# Altium schematic sheet IRF7314.SchDoc
size A4
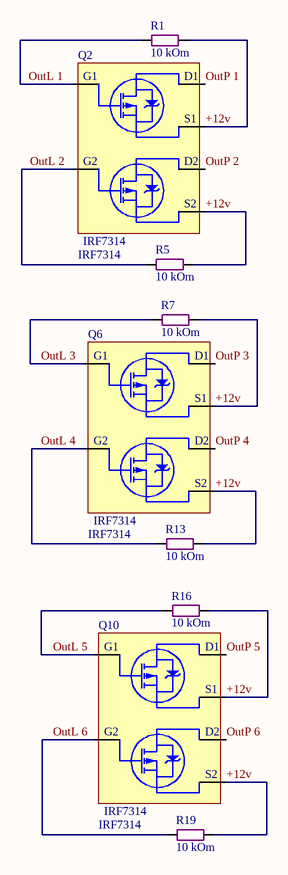
[diagram p0: IRF7314.SchDoc]

## Parts
Q2  IRF7314  [TSOP-6 (M)]
Q6  IRF7314  [TSOP-6 (M)]
Q10  IRF7314  [TSOP-6 (M)]
R1  10 kOm  [SMD 0603 (1608)]
R5  10 kOm  [SMD 0603 (1608)]
R7  10 kOm  [SMD 0603 (1608)]
R13  10 kOm  [SMD 0603 (1608)]
R16  10 kOm  [SMD 0603 (1608)]
R19  10 kOm  [SMD 0603 (1608)]

## Nets
+12v: Q2.2(S2) Q2.5(S1) Q6.2(S2) Q6.5(S1) Q10.2(S2) Q10.5(S1) R1.1 R5.1 R7.1 R13.1 R16.1 R19.1
OutL 1: Q2.1(G1) R1.2
OutL 2: Q2.3(G2) R5.2
OutL 3: Q6.1(G1) R7.2
OutL 4: Q6.3(G2) R13.2
OutL 5: Q10.1(G1) R16.2
OutL 6: Q10.3(G2) R19.2
OutP 1: Q2.6(D1)
OutP 2: Q2.4(D2)
OutP 3: Q6.6(D1)
OutP 4: Q6.4(D2)
OutP 5: Q10.6(D1)
OutP 6: Q10.4(D2)

## Library data of the parts
Q2 Q6 Q10 = IRF5850: Dual P-Ch  20V - 0.135Ω - 2.2A; Monufacturer: IOR; V DSS (v): -20 V; RDS Сопротивление Сток-Исток: 0.135 Om; I d - Drain current (continuous) at TC = 70°C: 1.8 A; VGS Порог Открытия: -0.45...-1.2 V; VGS Макс напр на гейте: +-12 V; C ISS Входная емкость: 320 pF; C OSS Выходная емкость: 56 pF; I d - Drain current (continuous) at TC = 25°C: 2.2 A; Name: IRF7314; Datasheet: http://tec.org.ru/_bd/4/490_IRF5850.pdf; URL: http://tec.org.ru/board/irf5850/49-1-0-490
R1 R5 R7 R13 R16 R19 = Res All Types